# Altium project EC20测试底板.PrjPcb
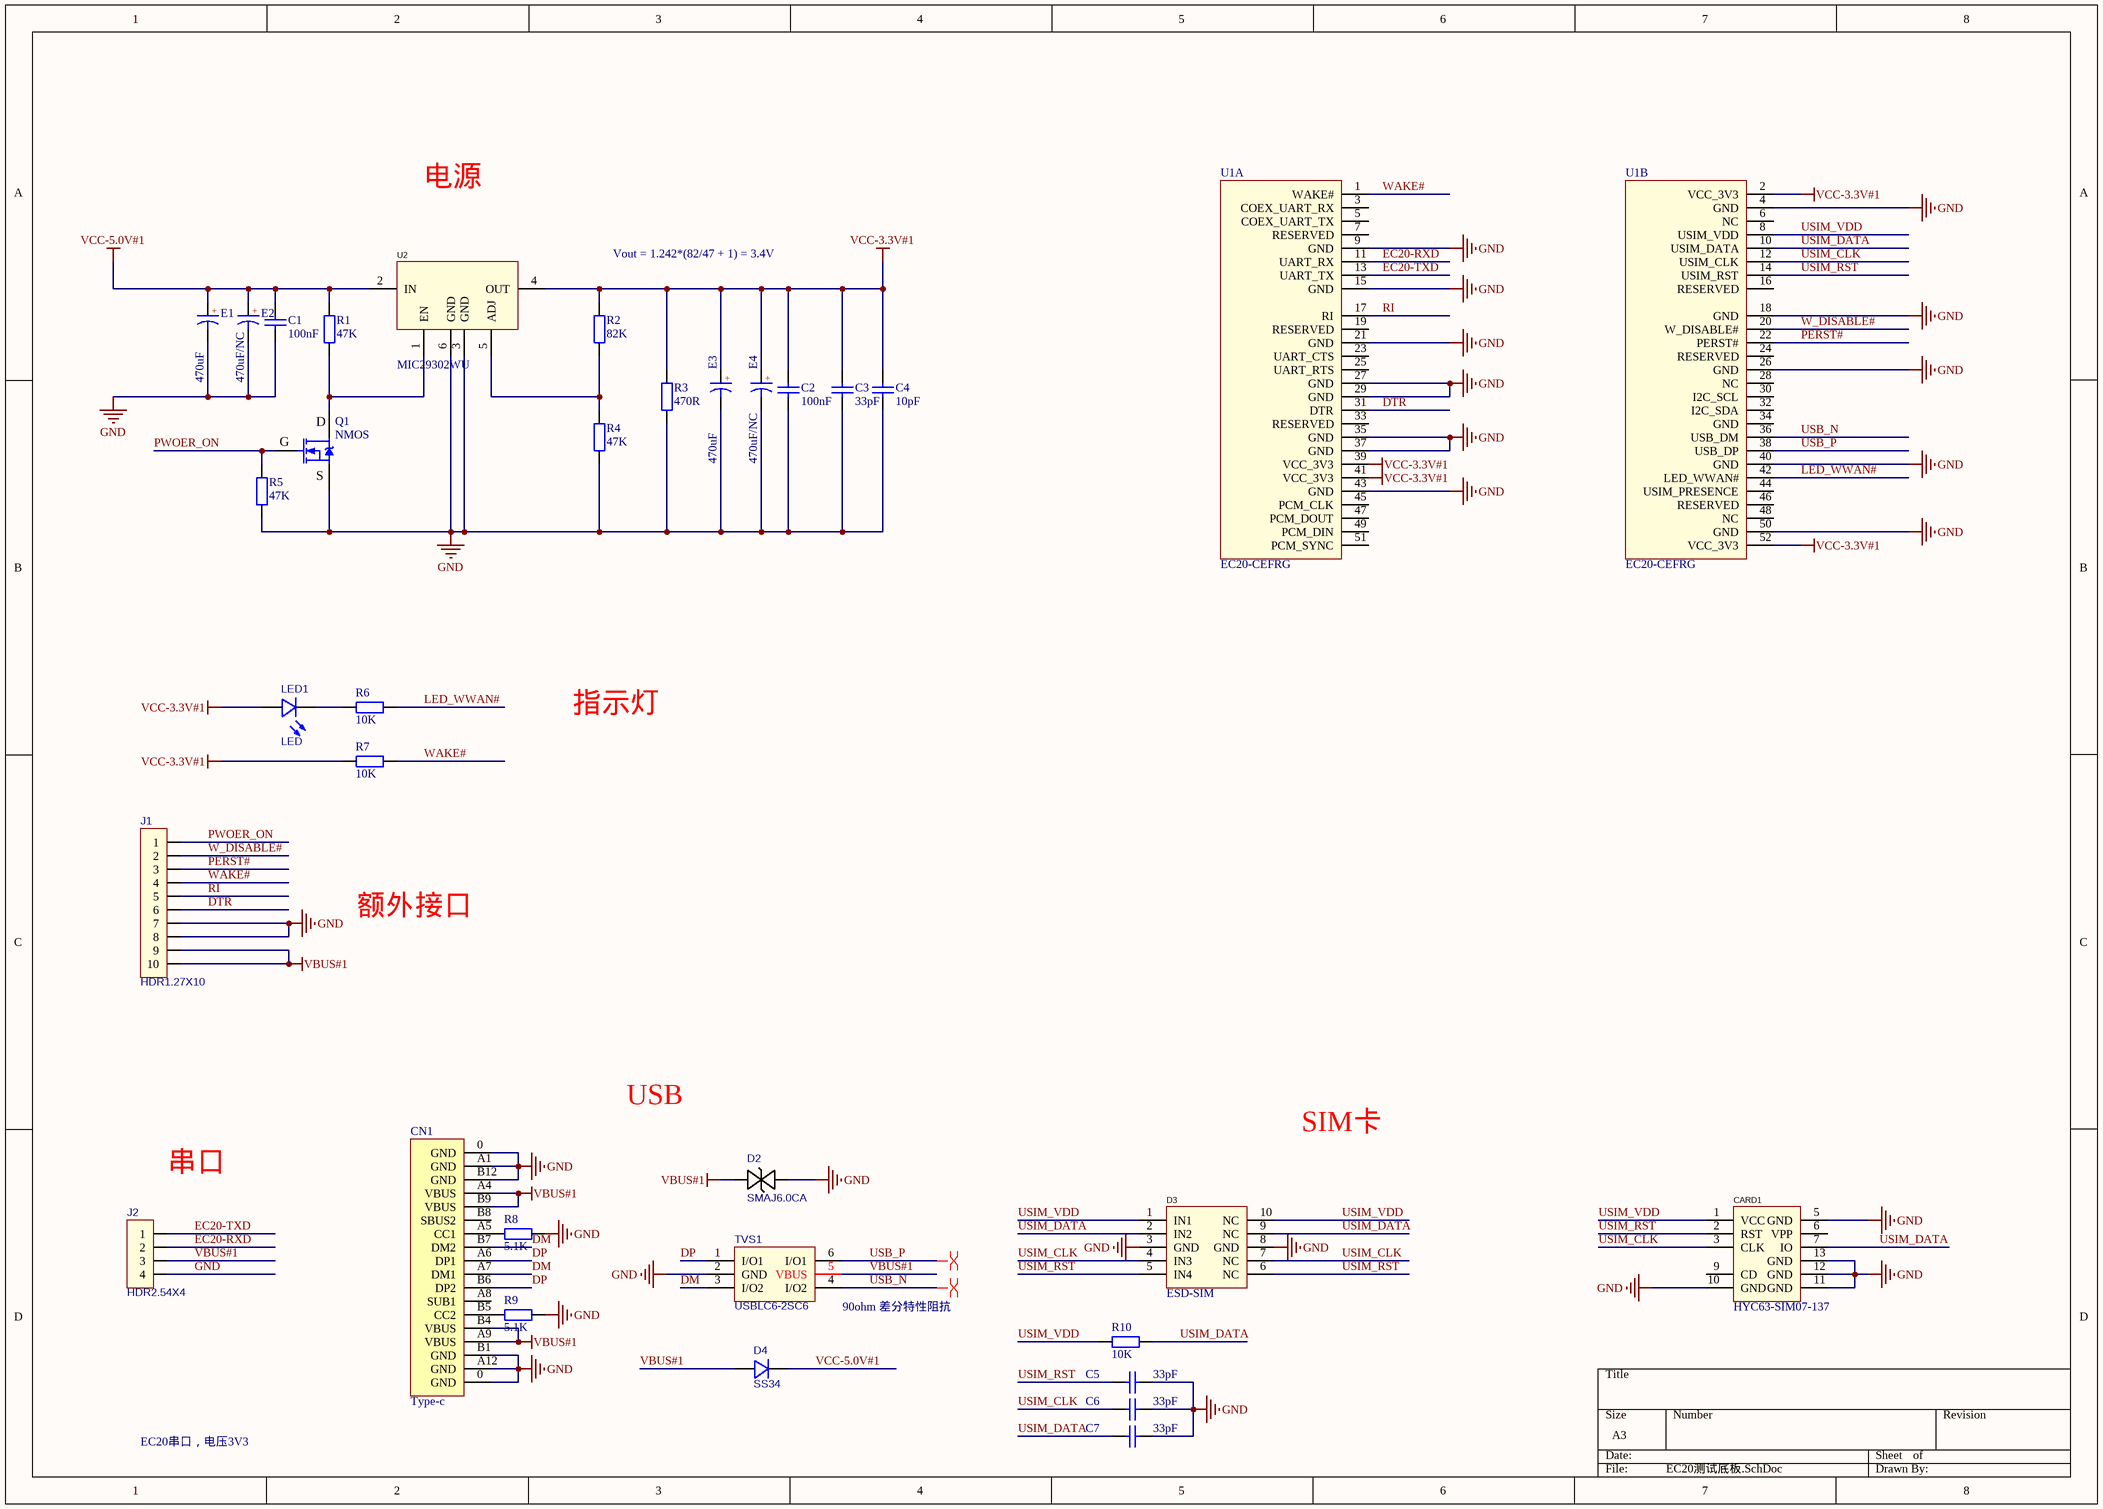
[diagram p0: EC20测试底板.SchDoc]
1 sheet, 33 parts. Net scope: global (net labels, ports and power ports of the same name join across sheets).
Board files: EC20测试底板.PcbDoc, 底板外壳.PcbDoc

## Sheet EC20测试底板.SchDoc
size A3; SheetNumber: 1; SheetTotal: 1

### Parts
C1  100nF  [0603-C]
C2  100nF  [0603-C]
C3  33pF  [0603-C]
C4  10pF  [0603-C]
C5  33pF  [0603-C]
C6  33pF  [0603-C]
C7  33pF  [0603-C]
CARD1  HYC63-SIM07-137  [NANO-SIM-SMD_HYC63-SIM07-137]
CN1  Type-c  [Type-c 16pin]
D2  SMAJ6.0CA  [ZENER]
D3  ESD-SIM  [SLP2510P8]
D4  SS34  [SS34-SMA]
E1  470uF  [CD D(7343)]
E2  470uF/NC  [CD D(7343)]
E3  470uF  [CD D(7343)]
E4  470uF/NC  [CD D(7343)]
J1  HDR1.27X10  [HDR2.54-LI-10P]
J2  HDR2.54X4  [HDR2.54-LI-4P]
LED1  LED  [LED-0603]
Q1  NMOS  [AO3400]
R1  47K  [0603-R]
R2  82K  [0603-R]
R3  470R  [0603-R]
R4  47K  [0603-R]
R5  47K  [0603-R]
R6  10K  [0603-R]
R7  10K  [0603-R]
R8  5.1K  [0603-R]
R9  5.1K  [0603-R]
R10  10K  [0603-R]
TVS1  USBLC6-2SC6  [USBLC6-2]
U1  EC20-CEFRG  [mini-PCI_E接口]  (parts A,B of 2)
U2  MIC29302WU  [MIC29302WU]

### Nets
GND: C1.1 C2.1 C3.1 C4.1 C5.1 C6.1 C7.1 CARD1.5(GND) CARD1.10(GND) CARD1.11(GND) CARD1.12(GND) CARD1.13(GND) CN1.0(GND) CN1.A1(GND) CN1.A12(GND) CN1.B1(GND) CN1.B12(GND) D2.2(A) D3.3(GND) D3.8(GND) E1.2(K) E2.2(K) E3.2(K) E4.2(K) J1.7 J1.8 J2.4 Q1.2(S) R3.1 R4.1 R5.1 R8.1 R9.2 TVS1.2(GND) U1.4(GND) U1.9(GND) U1.15(GND) U1.18(GND) U1.21(GND) U1.26(GND) U1.27(GND) U1.29(GND) U1.35(GND) U1.37(GND) U1.40(GND) U1.43(GND) U1.50(GND) U2.3(GND) U2.6(GND)
VBUS#1: CN1.A4(VBUS) CN1.A9(VBUS) CN1.B4(VBUS) CN1.B9(VBUS) D2.1(C) D4.1(+) J1.9 J1.10 J2.3 TVS1.5(VBUS)
VCC-3.3V#1: C2.2 C3.2 C4.2 E3.1(A) E4.1(A) LED1.2(+) R2.2 R3.2 R7.2 U1.2(VCC_3V3) U1.39(VCC_3V3) U1.41(VCC_3V3) U1.52(VCC_3V3) U2.4(OUT)
VCC-5.0V#1: C1.2 D4.2(-) E1.1(A) E2.1(A) R1.2 U2.2(IN)
DM: CN1.A7(DM1) CN1.B7(DM2) TVS1.3(I/O2)
DP: CN1.A6(DP1) CN1.B6(DP2) TVS1.1(I/O1)
DTR: J1.6 U1.31(DTR)
EC20-RXD: J2.2 U1.11(UART_RX)
EC20-TXD: J2.1 U1.13(UART_TX)
LED_WWAN#: R6.1 U1.42(LED_WWAN#)
PERST#: J1.3 U1.22(PERST#)
PWOER_ON: J1.1 Q1.1(G) R5.2
RI: J1.5 U1.17(RI)
USB_N: TVS1.4(I/O2) U1.36(USB_DM)
USB_P: TVS1.6(I/O1) U1.38(USB_DP)
USIM_CLK: C6.2 CARD1.3(CLK) D3.4(IN3) D3.7(NC) U1.12(USIM_CLK)
USIM_DATA: C7.2 CARD1.7(IO) D3.2(IN2) D3.9(NC) R10.1 U1.10(USIM_DATA)
USIM_RST: C5.2 CARD1.2(RST) D3.5(IN4) D3.6(NC) U1.14(USIM_RST)
USIM_VDD: CARD1.1(VCC) D3.1(IN1) D3.10(NC) R10.2 U1.8(USIM_VDD)
W_DISABLE#: J1.2 U1.20(W_DISABLE#)
WAKE#: J1.4 R7.1 U1.1(WAKE#)
NetCN1_A5: CN1.A5(CC1) R8.2
NetCN1_B5: CN1.B5(CC2) R9.1
NetLED1_1: LED1.1(-) R6.2
NetQ1_3: Q1.3(D) R1.1 U2.1(EN)
NetR2_1: R2.1 R4.2 U2.5(ADJ)

Not connected (* = marked no-connect by the designer): CARD1 6(VPP) 9(CD); CN1 A8(SUB1) B8(SBUS2); U1 3(COEX_UART_RX) 5(COEX_UART_TX) 6(NC) 7(RESERVED) 16(RESERVED) 19(RESERVED) 23(UART_CTS) 24(RESERVED) 25(UART_RTS) 28(NC) 30(I2C_SCL) 32(I2C_SDA) 33(RESERVED) 34(GND) 44(USIM_PRESENCE) 45(PCM_CLK) 46(RESERVED) 47(PCM_DOUT) 48(NC) 49(PCM_DIN) 51(PCM_SYNC)

### Layout directives
differential pair: USB_N, USB_P

### Notes on the sheet
- 电源
- Vout = 1.242*(82/47 + 1) = 3.4V
- 指示灯
- 额外接口
- USB
- 串口
- SIM卡
- (near TVS1) 90ohm 差分特性阻抗
- EC20串口，电压3V3
- (in symbol CT) +

### Library data of the parts
C1-C7 = C: 贴片电容; BOM名称: 无极性贴片电容; 联系卖家，免费查找封装: 唯一出售店铺网址https://shop463601444.taobao.com
CARD1 = NanoSIM卡座: 自弹式 NanoSIM卡 卡座 带CD PIN 带柱; Manufacturer: 华宇创; Add into BOM: yes; Body Height (Max): 1.25mm; Name: HYC63-SIM07-137; Symbol: HYC63-SIM07-137; Device: HYC63-SIM07-137; LCSC Part Name: 自弹式 NanoSIM卡 卡座 带CD PIN 带柱; Supplier Part: C645507; Manufacturer Part: HYC63-SIM07-137; Supplier Footprint: SMD; JLCPCB Part Class: Extended Part; Datasheet: https://atta.szlcsc.com/upload/public/pdf/source/20200616/C645507_89E3671A4105357B007331596DCB72F5.pdf; Supplier: LCSC; Convert to PCB: yes; Card Connection Mode: 自弹式; Card Type: NanoSIM卡; Connector Type: 卡座; Contact Material: -; Contact Plating: -; Operating Temperature Range: -20℃~+60℃
CN1 = Type-c: U262-161N-4BVC11
D2 = SMAJ6.0CA: SMAJ6.0CA_C698928; BOM_Manufacturer: Yangzhou Yangjie Elec Tech; Contributor: LCSC; BOM_Supplier: LCSC; BOM_Supplier Part: C698928; BOM_Manufacturer Part: SMAJ6.0CA; BOM_JLCPCB Part Class: Extended Part; spicePre: D; spiceSymbolName: SMAJ6.0CA_C698928
D3 = ESD-SIM: RClamp0524PATCT; Manufacturer: SEMTECH; Device: RClamp0524PATCT_C40960; Add into BOM: yes; Reverse Stand-Off Voltage (Vrwm): 5V; Breakdown Voltage (VBR): 6V; Clamping Voltage@Ipp: 15V; Peak Pulse Power(Ppp)@8/20us: 150W; Junction Capacitance(Cj)@1MHz: 0.8pF@1MHz; Name: RClamp0524PATCT; Symbol: RClamp0524PATCT; LCSC Part Name: RClamp0524PATCT; Supplier Part: C40960; Manufacturer Part: RClamp0524PATCT; Supplier Footprint: SLP2510P8; JLCPCB Part Class: Extended Part; Datasheet: https://atta.szlcsc.com/upload/public/pdf/source/20150124/1457707260739.pdf; Supplier: LCSC; Convert to PCB: yes; Operating Temperature: -55℃~+125℃@(Tj)
D4 = SS34: BOM_Manufacturer: Wuxi ARK Tech Elec; BOM_Manufacturer Part: D-G060306G1-KS2; Contributor: LCSC; BOM_Supplier: LCSC; BOM_Supplier Part: C118334; BOM_JLCPCB Part Class: Extended Part; spicePre: L; spiceSymbolName: D-G060306G1-KS2
E1-E4 = CT: 贴片钽电容; 联系卖家，免费查找封装: 唯一出售店铺网址https://shop463601444.taobao.com; BOM名称: 贴片钽电容
J1 = HDR2.54X10: BOM_Manufacturer: BOOMELE; BOM_Manufacturer Part: 1.27mm/1*3p; BOM_Supplier: LCSC; BOM_Supplier Part: C24980; BOM_JLCPCB Part Class: Extended Part; spicePre: P; spiceSymbolName: 1.27mm/1*3p
J2 = HDR2.54X4: BOM_Manufacturer: BOOMELE; BOM_Manufacturer Part: 1.27mm/1*3p; BOM_Supplier: LCSC; BOM_Supplier Part: C24980; BOM_JLCPCB Part Class: Extended Part; spicePre: P; spiceSymbolName: 1.27mm/1*3p
LED1 = LED: BOM_Manufacturer: Wuxi ARK Tech Elec; BOM_Manufacturer Part: D-G060306G1-KS2; Contributor: LCSC; BOM_Supplier: LCSC; BOM_Supplier Part: C118334; BOM_JLCPCB Part Class: Extended Part; spicePre: L; spiceSymbolName: D-G060306G1-KS2
Q1 = AO3400: N沟道 30V/4.2A; BOM名称: 场效应管; 联系卖家，免费查找封装: 唯一出售店铺网址https://shop463601444.taobao.com; 参数: N沟道 30V/4.2A
R1-R10 = R: 贴片电阻; 联系卖家，免费查找封装: 唯一出售店铺网址https://shop463601444.taobao.com; BOM名称: 贴片电阻
TVS1 = USBLC6-2SC6: USBLC6-2SC6_C2687116; BOM_Manufacturer: UMW(友台半导体); Contributor: LCSC; BOM_Supplier: LCSC; BOM_Supplier Part: C2687116; BOM_Manufacturer Part: USBLC6-2SC6; BOM_JLCPCB Part Class: Extended Part; spicePre: D; spiceSymbolName: USBLC6-2SC6_C2687116
U2 = MIC29302WU: Manufacturer: UMW(友台半导体); Symbol: MIC29302WU_C2995533; Add into BOM: yes; Name: MIC29302WU; Device: MIC29302WU; LCSC Part Name: 3A Fast-Response LDO Regulator; Supplier Part: C2995533; Manufacturer Part: MIC29302WU; Supplier Footprint: TO-263; JLCPCB Part Class: Extended Part; Datasheet: https://atta.szlcsc.com/upload/public/pdf/source/20220414/64A379364ACD2069C59BD188E91B8798.pdf; Supplier: LCSC; Convert to PCB: yes